# EAGLE design EnsembleOne (EAGLE 7.6.0)
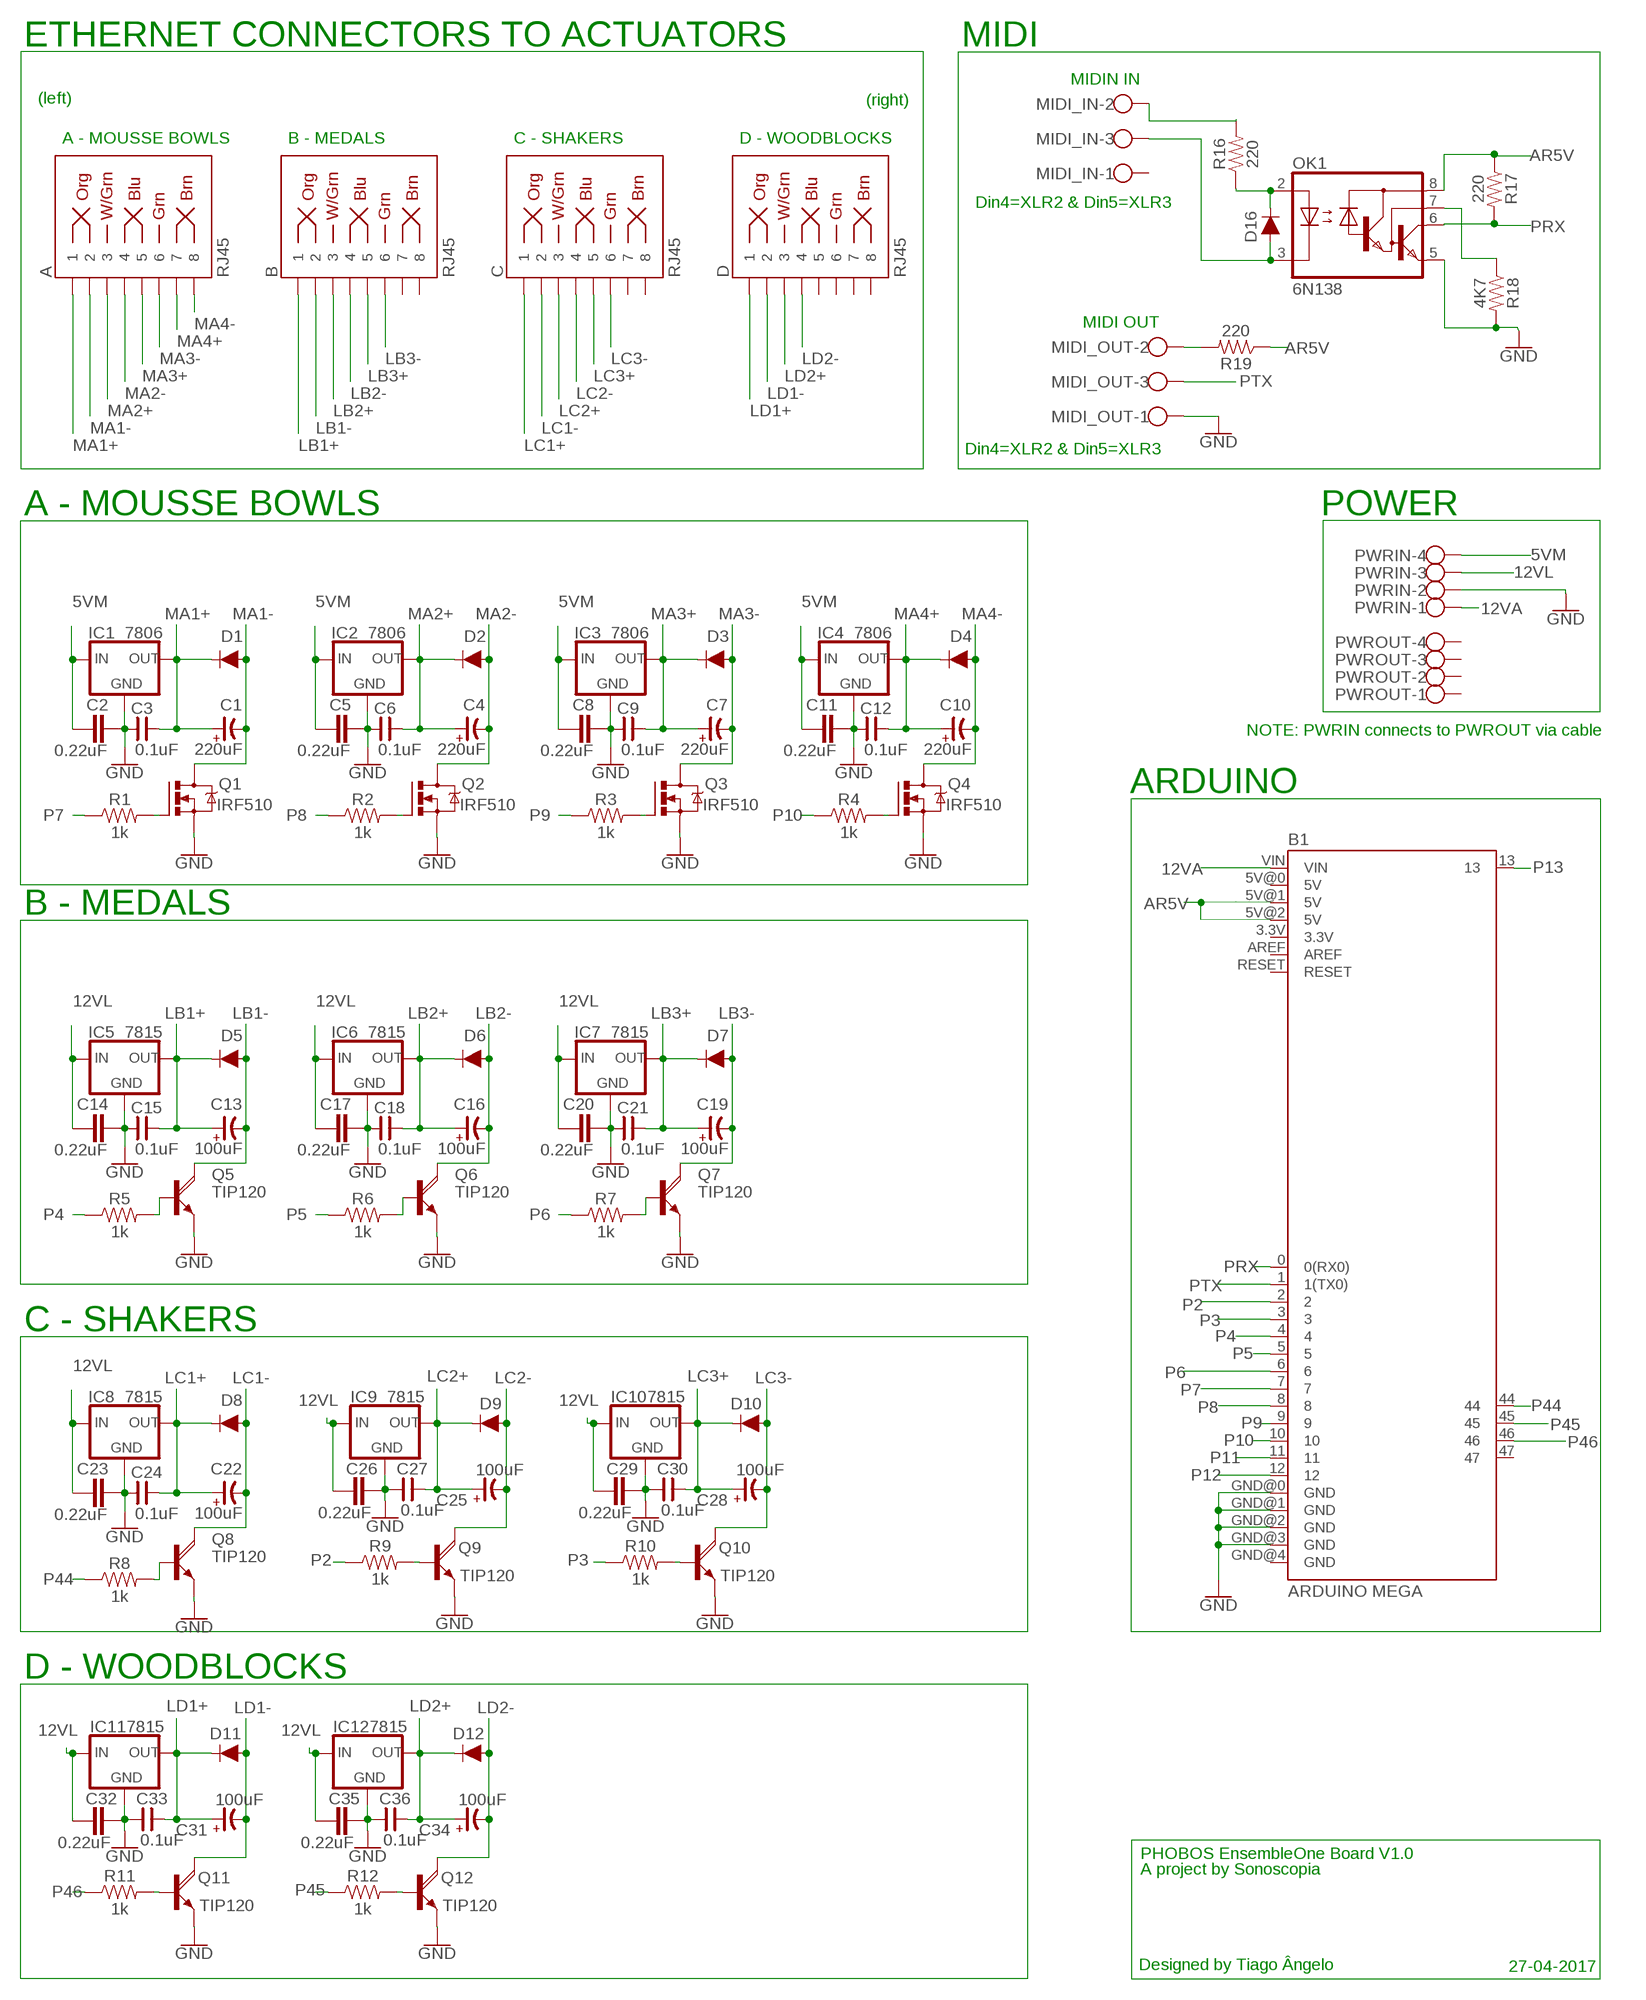
[diagram p0: schematic, sheet 1]

## Parts
A  RJ45  RJ45-8  [RJ45-8]
B  RJ45  RJ45-8  [RJ45-8]
B1  ARDUINO MEGA  ENSEMBLE_ONE_ARDUINO_MEGA_R3  [ENSEMBLE_ONE_ARDUINO_MEGA]
C  RJ45  RJ45-8  [RJ45-8]
C1  220uF  CP-E-035X080  [E-035X080]
C2  0.22uF  C5/3  [C5B3]
C3  0.1uF  CNP-C025-050X025  [C025-050X025]
C4  220uF  CP-E-035X080  [E-035X080]
C5  0.22uF  C5/3  [C5B3]
C6  0.1uF  CNP-C025-050X025  [C025-050X025]
C7  220uF  CP-E-035X080  [E-035X080]
C8  0.22uF  C5/3  [C5B3]
C9  0.1uF  CNP-C025-050X025  [C025-050X025]
C10  220uF  CP-E-035X080  [E-035X080]
C11  0.22uF  C5/3  [C5B3]
C12  0.1uF  CNP-C025-050X025  [C025-050X025]
C13  100uF  CAP-MASTER_CP-E-020X050  [CAP-MASTER_E-020X050]
C14  0.22uF  C5/3  [C5B3]
C15  0.1uF  CNP-C025-050X025  [C025-050X025]
C16  100uF  CAP-MASTER_CP-E-020X050  [CAP-MASTER_E-020X050]
C17  0.22uF  C5/3  [C5B3]
C18  0.1uF  CNP-C025-050X025  [C025-050X025]
C19  100uF  CAP-MASTER_CP-E-020X050  [CAP-MASTER_E-020X050]
C20  0.22uF  C5/3  [C5B3]
C21  0.1uF  CNP-C025-050X025  [C025-050X025]
C22  100uF  CAP-MASTER_CP-E-020X050  [CAP-MASTER_E-020X050]
C23  0.22uF  C5/3  [C5B3]
C24  0.1uF  CNP-C025-050X025  [C025-050X025]
C25  100uF  CP-E-020X050  [E-020X050]
C26  0.22uF  C5/3  [C5B3]
C27  0.1uF  CNP-C025-050X025  [C025-050X025]
C28  100uF  CP-E-020X050  [E-020X050]
C29  0.22uF  C5/3  [C5B3]
C30  0.1uF  CNP-C025-050X025  [C025-050X025]
C31  100uF  CP-E-020X050  [E-020X050]
C32  0.22uF  C5/3  [C5B3]
C33  0.1uF  CNP-C025-050X025  [C025-050X025]
C34  100uF  CP-E-020X050  [E-020X050]
C35  0.22uF  C5/3  [C5B3]
C36  0.1uF  CNP-C025-050X025  [C025-050X025]
D  RJ45  RJ45-8  [RJ45-8]
D1  1A/50V/1.1V  DIODE-KIT2  [DIODE-1N4001-KIT]
D2  1A/50V/1.1V  DIODE-KIT2  [DIODE-1N4001-KIT]
D3  1A/50V/1.1V  DIODE-KIT2  [DIODE-1N4001-KIT]
D4  1A/50V/1.1V  DIODE-KIT2  [DIODE-1N4001-KIT]
D5  1A/50V/1.1V  DIODE-KIT2  [DIODE-1N4001-KIT]
D6  1A/50V/1.1V  DIODE-KIT2  [DIODE-1N4001-KIT]
D7  1A/50V/1.1V  DIODE-KIT2  [DIODE-1N4001-KIT]
D8  1A/50V/1.1V  DIODE-KIT2  [DIODE-1N4001-KIT]
D9  1A/50V/1.1V  DIODE-KIT2  [DIODE-1N4001-KIT]
D10  1A/50V/1.1V  DIODE-KIT2  [DIODE-1N4001-KIT]
D11  1A/50V/1.1V  DIODE-KIT2  [DIODE-1N4001-KIT]
D12  1A/50V/1.1V  DIODE-KIT2  [DIODE-1N4001-KIT]
D16  200mA/100V/1V  DIODE-1N4148  [DIODE-1N4148]
IC1  7806  78XXS  [78XXS]
IC2  7806  78XXS  [78XXS]
IC3  7806  78XXS  [78XXS]
IC4  7806  78XXS  [78XXS]
IC5  7815  78XXS  [78XXS]
IC6  7815  78XXS  [78XXS]
IC7  7815  78XXS  [78XXS]
IC8  7815  78XXS  [78XXS]
IC9  7815  78XXS  [78XXS]
IC10  7815  78XXS  [78XXS]
IC11  7815  78XXS  [78XXS]
IC12  7815  78XXS  [78XXS]
MIDI_IN  W237-103  [W237-103]
MIDI_OUT  W237-103  [W237-103]
OK1  6N138  [DIL08]
PWRIN  W237-4  [W237-4]
PWROUT  W237-4  [W237-4]
Q1  IRF510  IRF520  [TO220BV]
Q2  IRF510  IRF520  [TO220BV]
Q3  IRF510  IRF520  [TO220BV]
Q4  IRF510  IRF520  [TO220BV]
Q5  TIP120  ROCKETFARM_TIP120V  [ROCKETFARM_TO220AV]
Q6  TIP120  ROCKETFARM_TIP120V  [ROCKETFARM_TO220AV]
Q7  TIP120  ROCKETFARM_TIP120V  [ROCKETFARM_TO220AV]
Q8  TIP120  ROCKETFARM_TIP120V  [ROCKETFARM_TO220AV]
Q9  TIP120  TIP120V  [TO220AV]
Q10  TIP120  TIP120V  [TO220AV]
Q11  TIP120  TIP120V  [TO220AV]
Q12  TIP120  TIP120V  [TO220AV]
R1  1k  1KOHM-VERT-1/4W-1%  [AXIAL-0.1]
R2  1k  1KOHM-VERT-1/4W-1%  [AXIAL-0.1]
R3  1k  1KOHM-VERT-1/4W-1%  [AXIAL-0.1]
R4  1k  1KOHM-VERT-1/4W-1%  [AXIAL-0.1]
R5  1k  1KOHM-VERT-1/4W-1%  [AXIAL-0.1]
R6  1k  1KOHM-VERT-1/4W-1%  [AXIAL-0.1]
R7  1k  1KOHM-VERT-1/4W-1%  [AXIAL-0.1]
R8  1k  1KOHM-VERT-1/4W-1%  [AXIAL-0.1]
R9  1k  1KOHM-VERT-1/4W-1%  [AXIAL-0.1]
R10  1k  1KOHM-VERT-1/4W-1%  [AXIAL-0.1]
R11  1k  1KOHM-VERT-1/4W-1%  [AXIAL-0.1]
R12  1k  1KOHM-VERT-1/4W-1%  [AXIAL-0.1]
R16  220  1KOHM-HORIZ-1/4W-5%  [AXIAL-0.3]
R17  220  1KOHM-HORIZ-1/4W-5%  [AXIAL-0.3]
R18  4K7  1KOHM-HORIZ-1/4W-5%  [AXIAL-0.3]
R19  220  1KOHM-HORIZ-1/4W-5%  [AXIAL-0.3]

## Nets
5VM [5VM]: C2.1 C5.1 C8.1 C11.1 IC1.IN IC2.IN IC3.IN IC4.IN PWRIN.4
12VA [12VA]: B1.VIN PWRIN.1
12VL [12VL]: C14.1 C17.1 C20.1 C23.1 C26.1 C29.1 C32.1 C35.1 IC5.IN IC6.IN IC7.IN IC8.IN IC9.IN IC10.IN IC11.IN IC12.IN PWRIN.3
AR5V: B1.5V@1(5V) B1.5V@2(5V) OK1.8(VCC) R17.P$1 R19.P$1
GND [GND]: B1.GND@0(GND) B1.GND@1(GND) B1.GND@2(GND) B1.GND@3(GND) C2.2 C3.1 C5.2 C6.1 C8.2 C9.1 C11.2 C12.1 C14.2 C15.1 C17.2 C18.1 C20.2 C21.1 C23.2 C24.1 C26.2 C27.1 C29.2 C30.1 C32.2 C33.1 C35.2 C36.1 IC1.GND IC2.GND IC3.GND IC4.GND IC5.GND IC6.GND IC7.GND IC8.GND IC9.GND IC10.GND IC11.GND IC12.GND MIDI_OUT.1 OK1.5(GND) PWRIN.2 Q1.S Q2.S Q3.S Q4.S Q5.E Q6.E Q7.E Q8.E Q9.E Q10.E Q11.E Q12.E R18.P$2
LB1+: B.1 C13.+ C15.2 D5.C IC5.OUT
LB1-: B.2 C13.- D5.A Q5.C
LB2+: B.3 C16.+ C18.2 D6.C IC6.OUT
LB2-: B.4 C16.- D6.A Q6.C
LB3+: B.5 C19.+ C21.2 D7.C IC7.OUT
LB3-: B.6 C19.- D7.A Q7.C
LC1+: C22.+ C24.2 C.1 D8.C IC8.OUT
LC1-: C22.- C.2 D8.A Q8.C
LC2+: C25.+ C27.2 C.3 D9.C IC9.OUT
LC2-: C25.- C.4 D9.A Q9.C
LC3+: C28.+ C30.2 C.5 D10.C IC10.OUT
LC3-: C28.- C.6 D10.A Q10.C
LD1+: C31.+ C33.2 D11.C D.1 IC11.OUT
LD1-: C31.- D11.A D.2 Q11.C
LD2+: C34.+ C36.2 D12.C D.3 IC12.OUT
LD2-: C34.- D12.A D.4 Q12.C
MA1+: A.1 C1.+ C3.2 D1.C IC1.OUT
MA1-: A.2 C1.- D1.A Q1.D
MA2+: A.3 C4.+ C6.2 D2.C IC2.OUT
MA2-: A.4 C4.- D2.A Q2.D
MA3+: A.5 C7.+ C9.2 D3.C IC3.OUT
MA3-: A.6 C7.- D3.A Q3.D
MA4+: A.7 C10.+ C12.2 D4.C IC4.OUT
MA4-: A.8 C10.- D4.A Q4.D
N$1: Q1.G R1.P$2
N$2: MIDI_OUT.2 R19.P$2
N$3: Q2.G R2.P$2
N$4: Q10.B R10.P$2
N$5: Q11.B R11.P$2
N$9: Q9.B R9.P$2
N$14: Q3.G R3.P$2
N$15: Q4.G R4.P$2
N$16: Q5.B R5.P$2
N$18: Q6.B R6.P$2
N$19: Q7.B R7.P$2
N$20: Q8.B R8.P$2
N$21: Q12.B R12.P$2
N$25: D16.A MIDI_IN.3 OK1.3(C)
N$26: D16.C OK1.2(A) R16.P$1
N$27: MIDI_IN.2 R16.P$2
N$29: OK1.7(VB) R18.P$1
P2: B1.2 R9.P$1
P3: B1.3 R10.P$1
P4: B1.4 R5.P$1
P5: B1.5 R6.P$1
P6: B1.6 R7.P$1
P7: B1.7 R1.P$1
P8: B1.8 R2.P$1
P9: B1.9 R3.P$1
P10: B1.10 R4.P$1
P11: B1.11
P12: B1.12
P13: B1.13
P44: B1.44 R8.P$1
P45: B1.45 R12.P$1
P46: B1.46 R11.P$1
PRX: B1.0(0(RX0)) OK1.6(VO) R17.P$2
PTX: B1.1(1(TX0)) MIDI_OUT.3
Unconnected: B1.3.3V B1.5V@0(5V) B1.47 B1.AREF B1.GND@4(GND) B1.RESET B.7 B.8 C.7 C.8 D.5 D.6 D.7 D.8 MIDI_IN.1 PWROUT.1 PWROUT.2 PWROUT.3 PWROUT.4

## Notes on the sheet
- ETHERNET CONNECTORS TO ACTUATORS | MIDI
- MIDIN IN
- (left) | (right)
- A - MOUSSE BOWLS | B - MEDALS | C - SHAKERS | D - WOODBLOCKS
- Din4=XLR2 & Din5=XLR3
- MIDI OUT
- Din4=XLR2 & Din5=XLR3
- A - MOUSSE BOWLS | POWER
- NOTE: PWRIN connects to PWROUT via cable
- ARDUINO
- B - MEDALS
- C - SHAKERS
- D - WOODBLOCKS
- PHOBOS EnsembleOne Board V1.0
- A project by Sonoscopia
- Designed by Tiago Ângelo | 27-04-2017

## Library data of the parts
A B C D = SparkFun-Connectors:RJ45-8: RJ45 Jack - 8 pin Simple RJ45, 8-pin connection. Commonly used for Cat5, Cat5e, and Cat6 Ethernet cables. Here is the connector we sell at SparkFun: RJ45 8-Pin Connector <https://www.sparkfun.com/products/643> (PRT-00643) Datasheet <https://cdn.sparkfun.com/datasheets/Prototyping/04908.pdf> It is used on this SparkFun product: SparkFun RJ45 Breakout <https://www.sparkfun.com/products/716> (BOB-00716) Note, you may also be interested in the "MAGJACK" version of this. It is basically a RJ45 connector, but also has some status LEDs built into the connector housing. You can check that out in this library at the device named "MAGJACK.dev" and see these products online: RJ45 Ethernet MagJack-Compatible <https://www.sparkfun.com/products/8534> (PRT-08534) SparkFun RJ45 MagJack Breakout <https://www.sparkfun.com/products/13021> (BOB-13021); PROD_ID: CONN-08506; SF_ID: PRT-00643
B1 = PHOBOS-lbr:ENSEMBLE_ONE_ARDUINO_MEGA_R3: Arduino Mega R3 ATmega2560 R3 compatible footprint. SparkFun Products: Arduino Mega 2560 R3 <https://www.sparkfun.com/products/11061>
C1 C4 C7 C10 C25 C28 C31 C34 = cap-master:CP-: POLARIZED CAP
C2 C5 C8 C11 C14 C17 C20 C23 C26 C29 C32 C35 = capacitor-wima:C: CAPACITOR naming: grid - package width
C3 C6 C9 C12 C15 C18 C21 C24 C27 C30 C33 C36 = cap-master:CNP-: NON-POLARIZED CAP
C13 C16 C19 C22 = PHOBOS-lbr:CAP-MASTER_CP-: POLARIZED CAP
D1-D12 = SparkFun-DiscreteSemi:DIODE: Diode These are standard reverse protection diodes and small signal diodes. SparkFun Products: SparkFun SparkPunk Sound Kit <https://www.sparkfun.com/products/11177> SparkFun ESP8266 Thing <https://www.sparkfun.com/products/13231>; PROD_ID: DIO-09176
D16 = SparkFun-DiscreteSemi:DIODE: Diode These are standard reverse protection diodes and small signal diodes. SparkFun Products: SparkFun SparkPunk Sound Kit <https://www.sparkfun.com/products/11177> SparkFun ESP8266 Thing <https://www.sparkfun.com/products/13231>; PROD_ID: DIO-08378
IC1-IC12 = v-reg:78XXS: VOLTAGE REGULATOR
MIDI_IN MIDI_OUT = con-wago-500:W237-103: WAGO SCREW CLAMP; MPN: 237-103; OC_FARNELL: unknown; OC_NEWARK: 18M7116
OK1 = optocoupler:6N138: MOTOROLA OPTO COUPLER; MF: VISHAY/TELEFUNKEN; MPN: 6N138; OC_FARNELL: 9860150; OC_NEWARK: 35K5294
PWRIN PWROUT = con-wago-500:W237-4: WAGO SCREW CLAMP; OC_FARNELL: unknown; OC_NEWARK: unknown
Q1-Q4 = transistor-power:IRF520: HEXFET Power MOSFET
Q5-Q8 = PHOBOS-lbr:ROCKETFARM_TIP120: NPN DARLINGTON TRANSISTOR
Q9-Q12 = rocketfarm:TIP120: NPN DARLINGTON TRANSISTOR
R1-R12 = SparkFun-Resistors:1KOHM: 1kΩ resistor A resistor is a passive two-terminal electrical component that implements electrical resistance as a circuit element. Resistors act to reduce current flow, and, at the same time, act to lower voltage levels within circuits. - Wikipedia; PROD_ID: RES-12182
R16-R19 = SparkFun-Resistors:1KOHM: 1kΩ resistor A resistor is a passive two-terminal electrical component that implements electrical resistance as a circuit element. Resistors act to reduce current flow, and, at the same time, act to lower voltage levels within circuits. - Wikipedia; PROD_ID: RES-08380; VALUE: 1k

## Net classes
0 default: width 0.508 mm, drill 0.508 mm, clearance 0.406 mm
1 GND: width 1.016 mm, drill 0.508 mm, clearance 0.508 mm
2 5VM: width 1.016 mm, drill 0.508 mm, clearance 0.508 mm
3 12VL: width 0.61 mm, drill 0.508 mm, clearance 0.508 mm
4 12VA: width 0.508 mm, drill 0.508 mm, clearance 0.508 mm

## Board
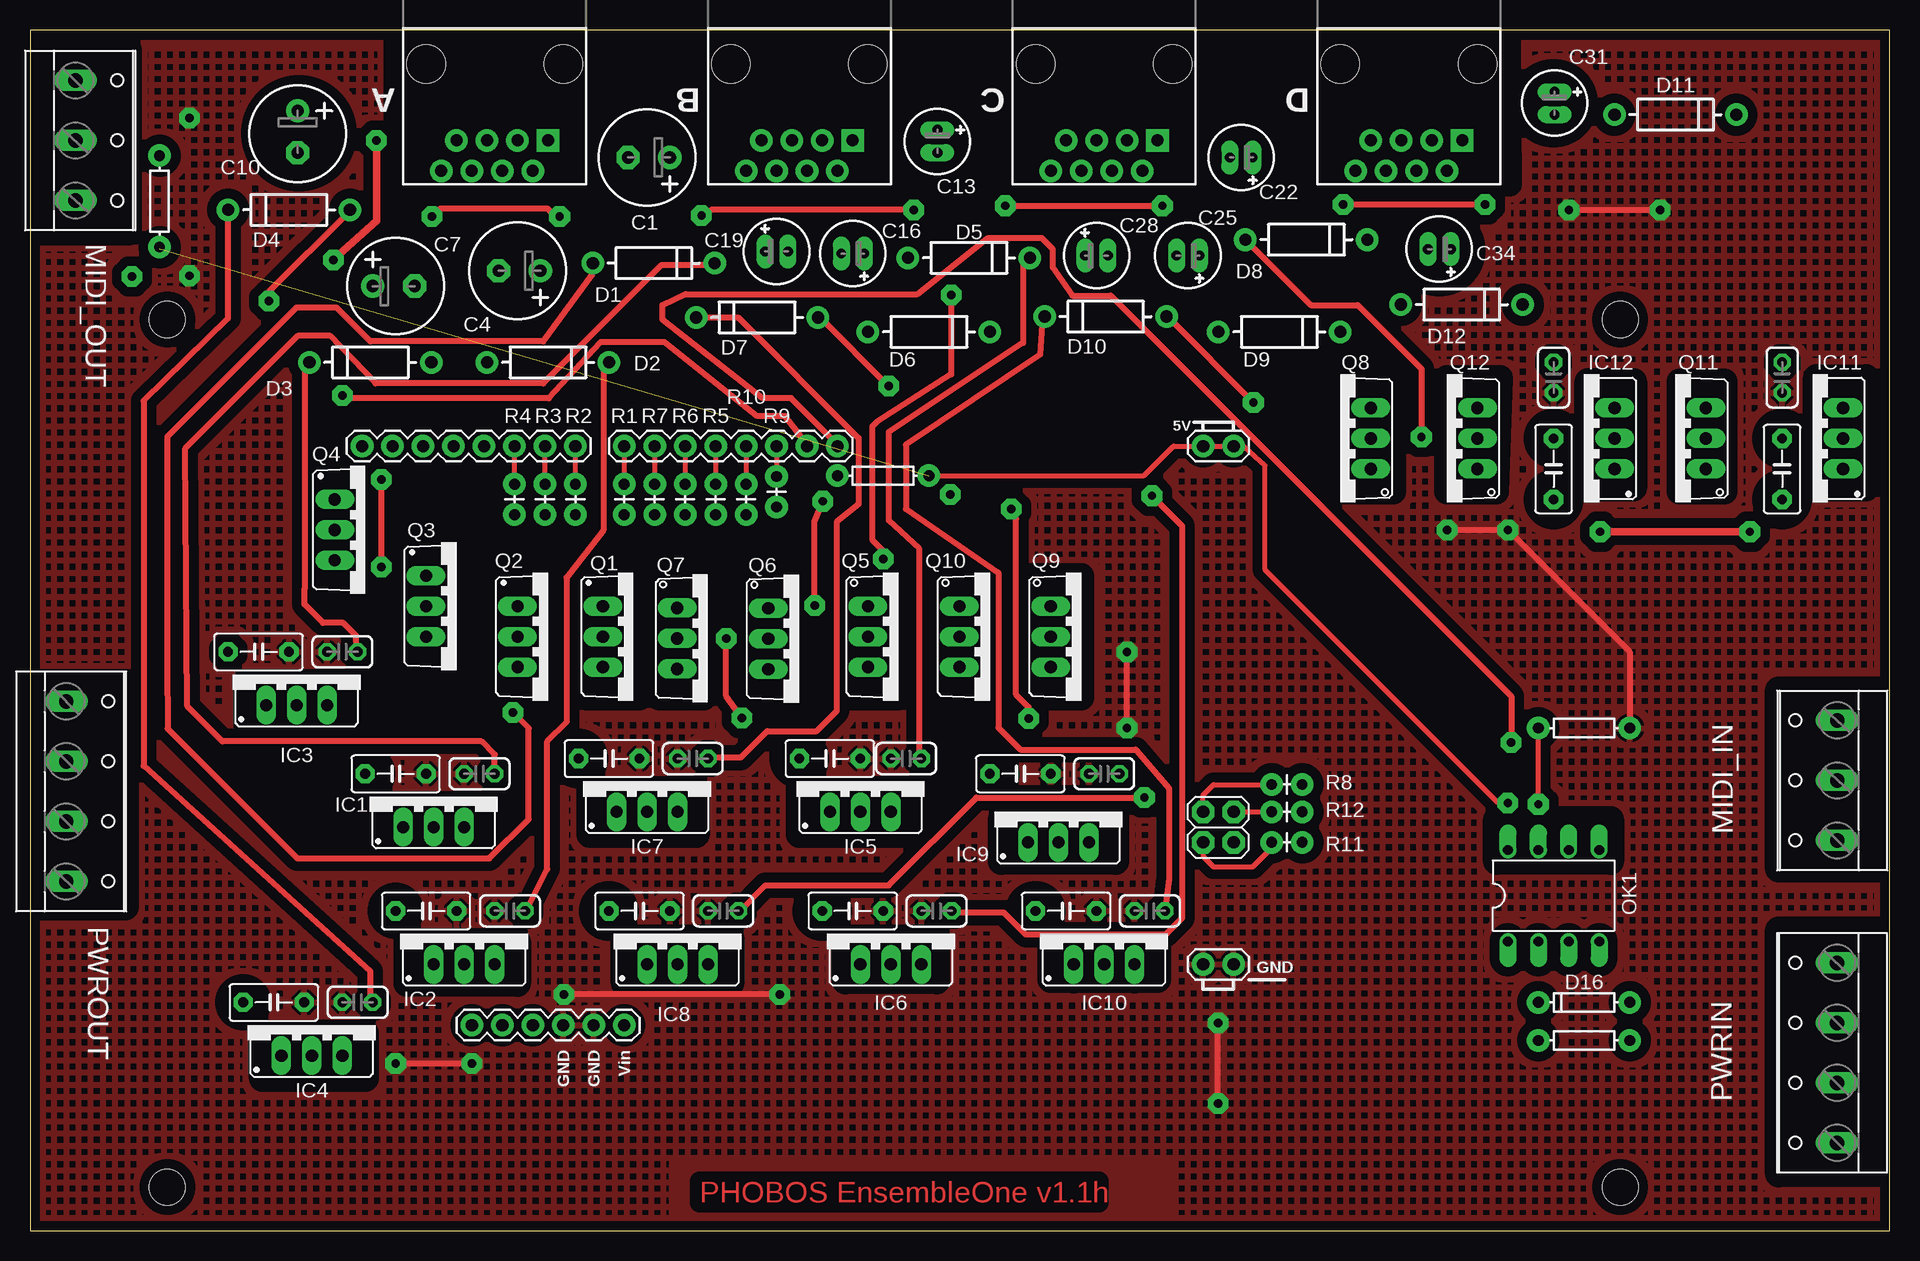
[diagram p1: board, top side]
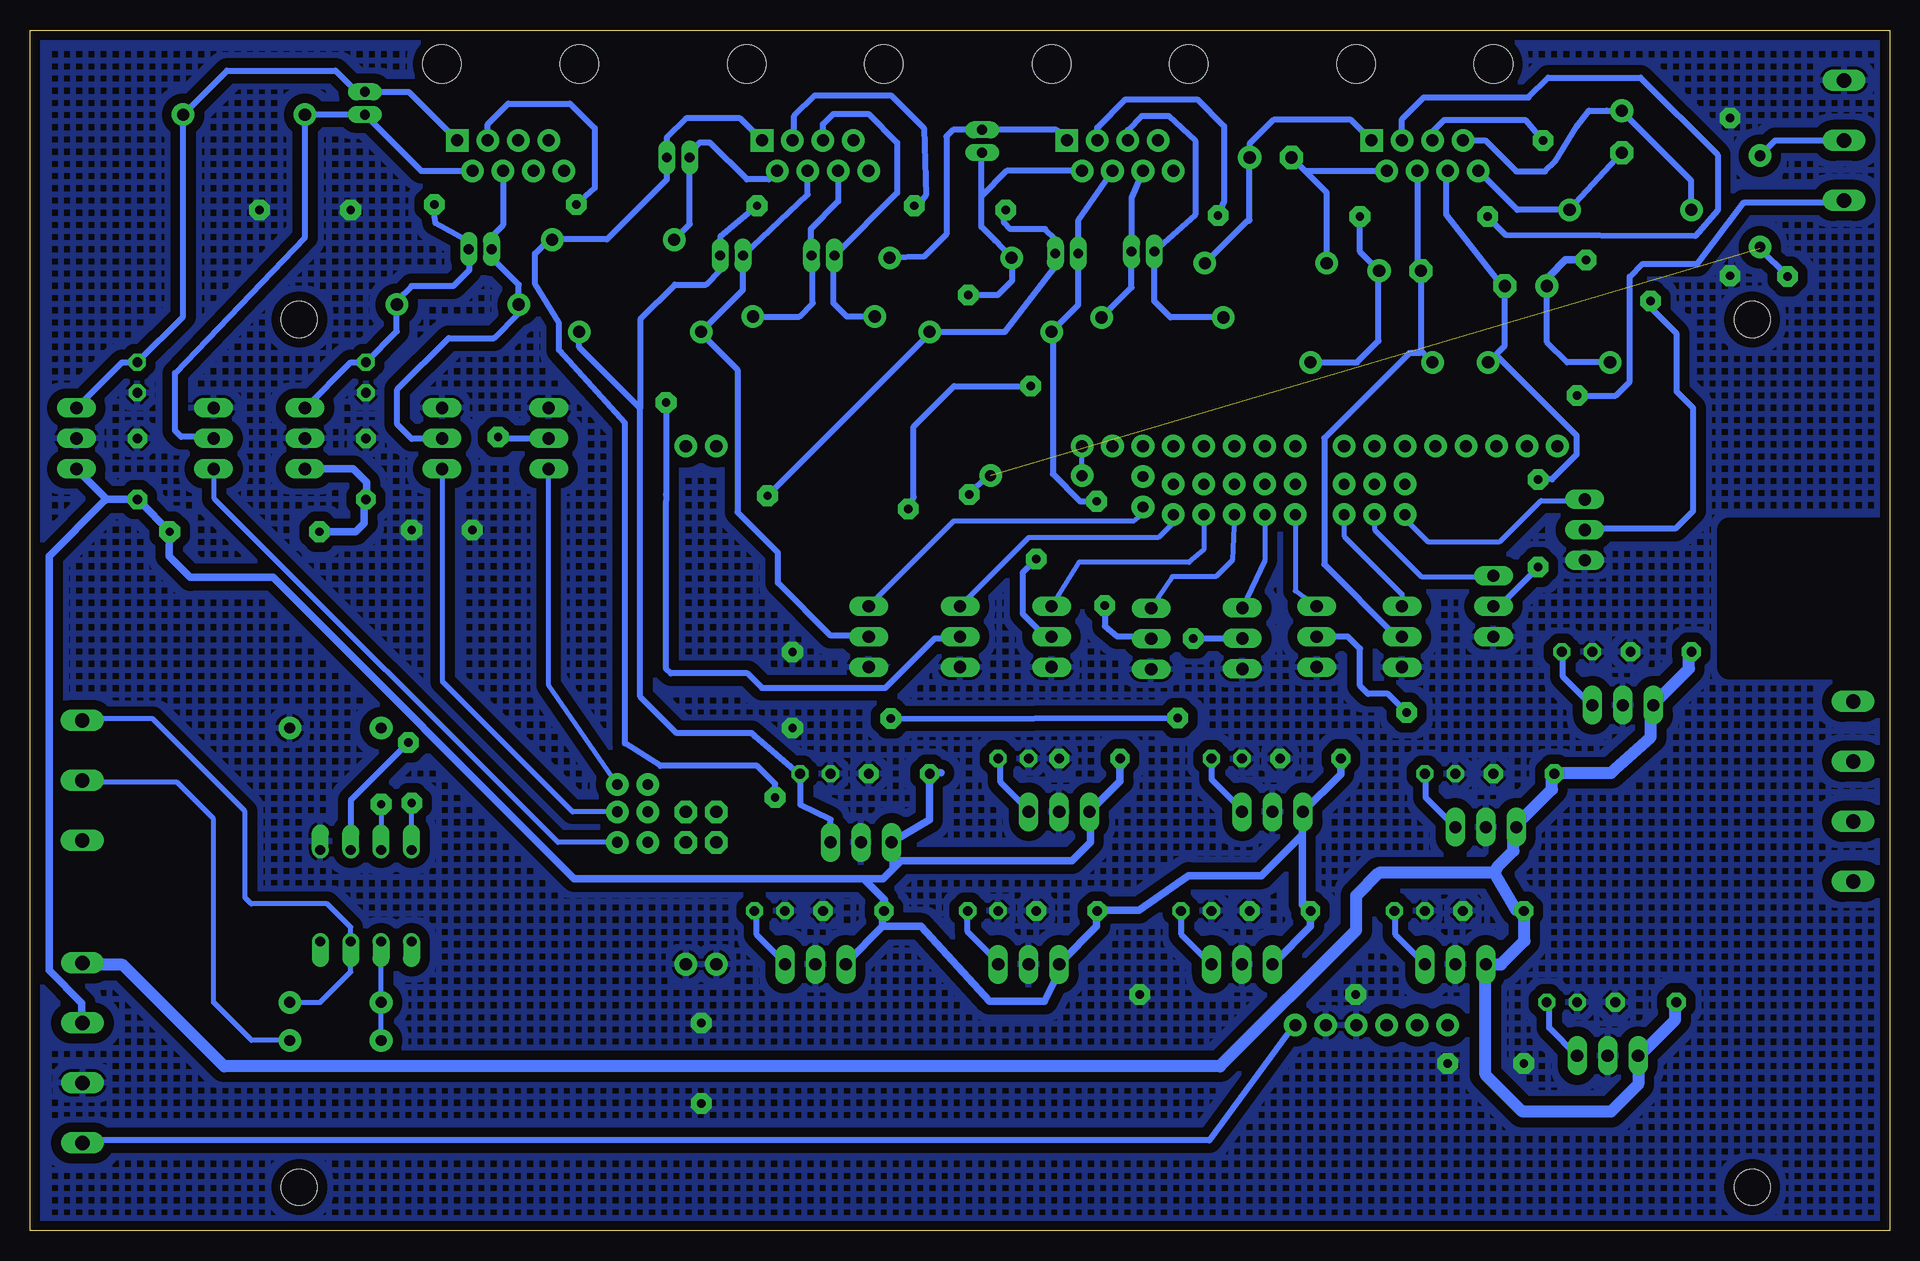
[diagram p2: board, bottom side, seen from below]

Size 155 x 100.08 mm. Coordinates in mm from the lower left corner, seen from the top.
Outline: 0,0 155,0 155,100.08 0,100.08 0,0
Copper layers (1*16): Top 0.035mm / dielectric 1.5mm / Bottom 0.035mm
Design rules "Dek": minimum track width 12mil, minimum drill 36mil, track to track 12mil, track to pad 12mil, pad to pad 12mil, via to via 12mil, smd to smd 0mil, copper to edge 10mil, drill to drill 12mil, minimum pad ring 12mil, minimum via ring 20mil, stop-mask expansion 4mil, vias tented up to drill 25mil, thermal gap 10mil
Holes 3 mm at 132.55,75.95 132.55,3.65 11.45,3.65 11.45,75.95
Holes 1.5 mm at -15.24,52.07 193.04,6.35 193.04,93.98
tRestrict: area 30.5,86.4 to 47,108; area 55.9,86.4 to 72.4,108; area 81.3,87.2 to 97.8,108; area 106.7,87.2 to 123.4,108; area 18.7,87.8 to 26.1,95.2; area 26.9,75.1 to 34.1,82.2; area 36.8,76.1 to 44.5,83.7; area 47.8,85.9 to 55.1,93.2; area 59.5,78.9 to 65,84.4; area 66,79 to 71.1,84.1; area 73,88.2 to 78.1,93.4; area 86.3,78.6 to 91.6,83.9; 46 more areas
bRestrict: area -2.5,47 to 13.3,58.4
vRestrict: area 71.1,64.1 to 91.4,66.7; area 96.5,36.2 to 101.6,64.1; area 96.5,23.5 to 101.6,31.1; area 53.3,15.9 to 73.7,18.4; area 76.2,15.9 to 96.5,18.4; area -2.5,47 to 13.3,58.4; area 122.2,25.1 to 132.1,30.8; area 10.2,84.5 to 11.4,89.5; area 18.5,83.9 to 24.7,86.3; area 25.2,71.2 to 31.5,73.6; area 40.1,71.2 to 46.3,73.6; area 57.6,74.8 to 63.6,77.4; 8 more areas

### Footprints (pad centres in the part's own frame; a part is rotated, then mirrored left to right if it is on the bottom)
RJ45-8 = drill 1 pad 1.88 square: 1 -4.445,6.35 | drill 1 pad 1.88: 2 -3.175,8.89; 3 -1.905,6.35; 4 -0.635,8.89; 5 0.635,6.35; 6 1.905,8.89; 7 3.175,6.35; 8 4.445,8.89 | hole 3.2: -5.715,0; 5.715,0
ENSEMBLE_ONE_ARDUINO_MEGA = drill 1.016 pad 1.88: 0 13.97,24.13; 1 11.43,24.13; 2 8.89,24.13; 3 6.35,24.13; 3.3V -13.97,-24.13; 4 3.81,24.13; 5 1.27,24.13; 5V@0 -11.43,-24.13; 5V@1 44.45,24.13; 5V@2 46.99,24.13; 6 -1.27,24.13; 7 -3.81,24.13; 8 -7.874,24.13; 9 -10.414,24.13; 10 -12.954,24.13; 11 -15.494,24.13; 12 -18.034,24.13; 13 -20.574,24.13; AREF -25.654,24.13; GND@0 -8.89,-24.13; GND@1 -6.35,-24.13; GND@2 44.45,-19.05; GND@3 46.99,-19.05; GND@4 -23.114,24.13; RESET -16.51,-24.13; VIN -3.81,-24.13 | drill 1.016 pad 1.88 octagon: 44 44.45,-6.35; 45 46.99,-6.35; 46 44.45,-8.89; 47 46.99,-8.89
E-035X080 = drill 1.016 pad 1.93: + -1.905,0 | drill 1.016 pad 1.93 octagon: - 1.587,0
C5B3 = drill 0.813 pad 1.6 octagon: 1 -2.54,0; 2 2.54,0
C025-050X025 = drill 0.813 pad 1.422 octagon: 1 -1.27,0; 2 1.27,0
CAP-MASTER_E-020X050 = drill 0.813 long: + -0.953,0; - 0.953,0
E-020X050 = drill 0.813 long: + -0.953,0; - 0.953,0
DIODE-1N4001-KIT = drill 1.016 pad 1.88: A -5.08,0; C 5.08,0
DIODE-1N4148 = drill 0.9 pad 1.88: A -3.81,0; C 3.81,0
78XXS = drill 1.016 long: GND 0,-2.54; IN -2.54,-2.54; OUT 2.54,-2.54
W237-103 = drill 1.194 long: 1 -5,-1.29; 2 0,-1.29; 3 5,-1.29
DIL08 = drill 0.813 offset: 1 -3.81,-3.81; 2 -1.27,-3.81; 3 1.27,-3.81; 4 3.81,-3.81; 5 3.81,3.81; 6 1.27,3.81; 7 -1.27,3.81; 8 -3.81,3.81
W237-4 = drill 1.194 long: 1 -7.5,-1.27; 2 -2.5,-1.27; 3 2.5,-1.27; 4 7.5,-1.27
TO220BV = drill 1.016 long: D 0,-2.54; G -2.54,-2.54; S 2.54,-2.54
ROCKETFARM_TO220AV = drill 1.016 long: B -2.54,-2.54; C 0,-2.54; E 2.54,-2.54
TO220AV = drill 1.016 long: B -2.54,-2.54; C 0,-2.54; E 2.54,-2.54
AXIAL-0.1 = drill 0.9 pad 1.88: P$1 -1.27,0; P$2 1.27,0
AXIAL-0.3 = drill 0.9 pad 1.88: P$1 -3.81,0; P$2 3.81,0

### Placement (x,y rotation side)
A  38.73,97.23 180 top
B  64.13,97.23 180 top
B1  53.34,41.27 0 top
C  89.53,97.23 180 top
C1  51.43,89.46 180 top
C2  30.48,38.1 0 top
C3  37.46,38.1 0 top
C4  40.64,80.01 180 top
C5  33.02,26.67 0 top
C6  40.01,26.67 0 top
C7  30.48,78.74 0 top
C8  19.05,48.26 0 top
C9  26.03,48.26 0 top
C10  22.3,91.44 270 top
C11  20.32,19.05 0 top
C12  27.3,19.05 0 top
C13  75.64,90.81 270 top
C14  66.68,39.37 0 top
C15  73.03,39.37 0 top
C16  68.58,81.45 180 top
C17  68.58,26.67 0 top
C18  75.56,26.67 0 top
C19  62.23,81.62 0 top
C20  48.26,39.37 0 top
C21  55.24,39.37 0 top
C22  100.97,89.46 180 top
C23  50.8,26.67 0 top
C24  57.79,26.67 0 top
C25  96.52,81.28 180 top
C26  82.55,38.1 0 top
C27  89.53,38.1 0 top
C28  88.9,81.28 0 top
C29  86.36,26.67 0 top
C30  93.34,26.67 0 top
C31  127.08,93.98 270 top
C32  146.05,63.5 90 top
C33  146.05,71.12 90 top
C34  117.47,81.81 180 top
C35  127,63.5 90 top
C36  127,71.12 90 top
D  114.94,97.23 180 top
D1  51.99,80.64 0 top
D2  43.18,72.39 0 top
D3  28.37,72.38 180 top
D4  21.59,85.09 180 top
D5  78.26,81.1 0 top
D6  74.93,74.93 0 top
D7  60.6,76.12 180 top
D8  106.39,82.6 0 top
D9  104.14,74.93 0 top
D10  89.66,76.2 180 top
D11  137.16,93.03 0 top
D12  119.34,77.2 0 top
D16  129.54,19.05 180 top
IC1  33.66,36.2 0 top
IC2  36.2,24.77 0 top
IC3  22.23,46.35 0 top
IC4  23.49,17.14 0 top
IC5  69.22,37.47 0 top
IC6  71.75,24.77 0 top
IC7  51.43,37.47 0 top
IC8  53.98,24.77 0 top
IC9  85.72,34.92 0 top
IC10  89.53,24.77 0 top
IC11  148.59,66.04 90 top
IC12  129.54,66.04 90 top
MIDI_IN  149.35,37.54 90 top
MIDI_OUT  5.08,90.88 270 top
OK1  127,27.94 0 top
PWRIN  149.35,14.84 90 top
PWROUT  4.3,36.63 270 top
Q1  50.29,49.53 270 top
Q2  43.18,49.53 270 top
Q3  35.56,52.07 270 top
Q4  27.94,58.42 270 top
Q5  72.39,49.53 270 top
Q6  64.08,49.36 270 top
Q7  56.49,49.38 270 top
Q8  109.22,66.04 90 top
Q9  87.63,49.53 270 top
Q10  80.01,49.53 270 top
Q11  137.16,66.04 90 top
Q12  118.11,66.04 90 top
R1  49.53,60.96 270 top
R2  45.47,60.96 270 top
R3  42.93,60.96 270 top
R4  40.39,60.96 270 top
R5  57.15,60.96 270 top
R6  54.61,60.96 270 top
R7  52.07,60.96 270 top
R8  104.78,37.21 0 top
R9  62.23,61.59 270 top
R10  59.69,60.96 270 top
R11  104.78,32.38 0 top
R12  104.78,34.92 0 top
R16  129.54,15.88 0 top
R17  71.12,62.94 180 top
R18  129.54,41.91 0 top
R19  10.79,85.8 90 top

### Tracks (layer width: path | path; a pad name or v marks a point on that pad's centre or on a via)
5VM
  Bottom 1.016: C11.1 17.86,18.97 17.86,17.6 20.83,14.63 IC4.IN 20.95,12.22 23.23,9.94 30.6,9.94 33.69,13.03 33.69,22.19 IC2.IN 32.38,22.23 30.43,24.17 30.43,26.62 C5.1 31.12,26.75 32.94,29.84 | C8.1 16.71,48.23 16.71,46.86 19.69,43.89 IC3.IN 19.91,43.43 19.91,41.15 23.23,38.18 27.46,38.18 C2.1 28.14,37.95 28.14,36.8 31.12,33.83 IC1.IN 31.34,33.38 31.34,31.67 32.71,30.3 32.94,29.84 | 32.94,29.84 42.55,29.84 44.45,27.94 44.45,25.07 55.8,13.72 138.81,13.72 147.27,22.17 150.44,22.17 PWRIN.4
12VA
  Bottom 0.508: PWRIN.1 150.44,7.54 56.69,7.54 49.63,17.14 B1.VIN
12VL  (via drill 0.7)
  Top 0.61: v143.36,58.27 v130.86,58.27
  Bottom 0.61: IC11.IN 148.59,60.96 | 148.59,60.96 C32.1 145.87,60.81 v143.36,58.27 143.42,58.21 143.42,56.24 141.64,54.46 134.72,54.46 109.63,29.36 85.51,29.36 | PWRIN.3 150.67,17.37 150.67,18.97 153.42,21.72 153.42,56.24 148.84,60.81 148.59,60.96 | 64.49,39.22 C14.1 64.13,37.47 IC5.IN 66.6,34.85 66.6,32.4 68.15,30.86 82.38,30.86 83.06,30.18 | 83.92,25.38 83.92,26.52 C29.1 83.75,26.74 83.75,27.6 85.51,29.36 | 83.92,25.38 86.89,22.4 IC10.IN | C20.1 45.74,39.22 45.74,38.08 IC7.IN 48.95,34.65 48.95,33.02 | IC8.IN 51.23,22.4 48.26,25.38 C23.1 48.49,26.75 48.95,27.2 48.95,33.02 | 83.92,25.38 80.72,25.38 75.01,19.14 70.43,19.14 69.29,21.49 69.29,21.95 IC6.IN 69.06,22.4 66.09,25.38 66.09,26.52 C17.1 65.86,26.75 62.56,26.75 58.42,29.62 52.35,29.62 48.95,33.02 | v130.86,58.27 127.84,58.27 127.13,58.98 127.13,60.83 C35.1 126.96,61 126.96,62.41 128.05,63.5 IC12.IN | 79.06,38.18 79.81,38.18 C26.1 80.03,37.95 80.03,34.27 IC9.IN 83.06,32.26 83.06,30.18 | 85.51,29.36 83.88,29.36 83.06,30.18
AR5V  (via drill 0.7)  (1 unrouted)
  Top 0.406: R17.P$1 92.85,62.94 95.32,65.41 B1.5V@1 B1.5V@2 101.16,65.41 101.24,65.32 102.95,63.78 102.95,55.11 122.4,35.66 v123.18,35.66
  Bottom 0.406: OK1.8 v123.18,35.66
  Bottom 0.508: v8.48,79.55 10.79,81.86 R19.P$1 | v76.72,61.38 75.16,62.94 R17.P$1
GND  (via drill 0.7)
  Top 0.508: v118.11,58.42 v123.19,58.42 133.35,48.26 R18.P$2 | v128.27,85.09 v135.89,85.09 | v99.03,10.63 v99.03,17.32 | v30.48,13.97 v36.83,13.97 | v62.49,19.72 v44.49,19.72 | v91.44,41.91 v91.44,48.26
  other vias: 13.28,79.6 13.28,92.75
  pour Bottom (isolate 0.813, rank 2, hatched): -5.08,104.14 160.02,104.14 160.02,0 -5.08,0
  pour Top (isolate 0.813, hatched): -3.81,102.87 158.75,102.87 158.75,-2.54 -3.81,-2.54
LB1+
  Top 0.508: C15.2 74.09,39.45 74.09,56.9 71.58,59.21 71.58,66.58 82.78,74.01 82.78,80.47 83.24,80.92 D5.C
  Bottom 0.508: D5.C 80.49,81.2 78.61,83.08 78.61,91.21 78.06,91.76 C13.+ 69.46,91.76 B.1 | C15.2 74.09,39.22 74.09,37.39 71.81,35.1 IC5.OUT
LB1-  (via drill 0.7)
  Top 0.508: v76.78,78.01 76.78,71.38 70.61,67.44 70.21,67.04 70.21,57.61 71.12,56.69 v71.12,56.01
  Bottom 0.508: D5.A 74.57,82.55 75.69,83.67 75.69,86.24 | 75.69,86.24 75.69,89.8 C13.- | B.2 73.59,88.34 75.69,86.24 | v71.12,56.01 72.26,54.86 72.26,51.44 70.43,49.61 69.98,49.61 Q5.C | 73.41,80.92 D5.A | v76.78,78.01 74.32,78.01 73.12,79.21 73.12,81.03 D5.A
LB2+  (via drill 0.7)
  Top 0.508: v55.98,84.63 56.78,85.09 v73.66,85.09 | v93.52,61.27 96.04,58.75 96.04,26.06 94.67,24.69 83.01,24.69 81.18,26.52 76.84,26.52 C18.2
  Bottom 0.508: B.3 66.04,91.95 63.69,94.3 57.69,94.3 55.46,92.07 55.46,85.83 v55.98,84.63 | v73.66,85.09 73.81,84.94 73.81,84.01 73.29,83.5 70.38,83.5 69.53,82.65 C16.+ 69.53,80.4 73.73,74.93 D6.C 80.03,74.75 v93.52,61.27 | C18.2 76.84,24.92 74.32,22.4 IC6.OUT
LB2-  (via drill 0.7)
  Top 0.508: v65.41,52.12 65.38,59.1 v66.09,60.81
  Bottom 0.508: B.4 67.63,84.21 C16.- 67.63,77.15 D6.A 69.75,74.75 69.75,63.09 67.46,60.81 v66.09,60.81 | 62.36,49.66 Q6.C 62.25,49.55 64.38,49.55 65.41,50.41 v65.41,52.12
LB3+
  Top 0.508: D7.C 59,76.12 69.06,66.06 69.06,60.58 67.23,59.09 67.23,43.32 65.58,41.66 61.45,41.66 59.23,39.45 56.72,39.45 C21.2
  Bottom 0.508: B.5 63.5,91.75 62.32,92.93 60.09,92.93 57.86,90.87 57.86,84.7 C19.+ 61.29,81.27 61.29,77.5 59.92,76.12 D7.C | C21.2 56.49,39.22 56.49,37.62 53.98,35.1 IC7.OUT
LB3-  (via drill 0.7)
  Top 0.508: v83.24,42.69 83.24,43.66 82.21,44.69 82.21,59.32 81.81,59.72 v81.81,60.18 | v71.58,70.41 65.86,76.12 D7.A | v59.32,42.76 58.03,44.56 v58.03,49.38
  Bottom 0.508: B.6 63.18,86.12 C19.- 63.18,78.63 D7.A | v83.24,42.69 v59.32,42.76 | v81.81,60.18 81.35,61.15 81.35,67.04 77.98,70.41 v71.58,70.41 | v58.03,49.38 Q7.C
LC1+  (via drill 0.7)
  Top 0.508: v92.89,36.12 78.89,36.12 71.58,28.8 61.29,28.8 59.23,26.75 C24.2
  Bottom 0.508: C.1 95.81,92.71 100.33,92.71 101.92,91.12 C22.+ 101.92,87.62 106.9,82.64 111.43,82.64 D8.C 111.73,82.6 112.9,81.44 112.9,78.94 110.9,75.67 110.9,73.41 105.41,67.31 105.41,40.64 102.44,38.75 94.38,38.75 92.89,37.26 v92.89,36.12 | C24.2 59,26.52 59,24.69 56.72,22.4 IC8.OUT
LC1-  (via drill 0.7)
  Top 0.508: D8.A 106.76,77.15 110.67,77.15 115.98,71.84 v115.98,66.18
  Bottom 0.508: D8.A 100.01,83.9 C22.- 100.01,89.86 99.18,90.7 98.32,90.7 95.25,87.63 93.42,87.63 C.2 | v115.98,66.18 115.84,66.04 Q8.C
LC2+  (via drill 0.7)
  Top 0.508: v81.28,85.43 v94.39,85.43
  Bottom 0.508: C.3 91.29,91.03 91.29,92.93 89.58,94.64 83.24,94.64 80.49,91.9 80.32,86.31 81.28,85.11 v81.28,85.43 | v94.39,85.43 97.47,82.87 C25.+ 97.47,80.06 98.67,78.87 101.24,78.87 104.14,75.97 104.14,68.58 | IC9.OUT 88.26,34.29 90.78,35.53 90.78,37.95 C27.2 91.01,38.18 94.61,41.26 94.84,41.49 101.1,41.49 104.14,44.53 104.14,68.58 | 104.14,68.58 109.22,73.66 D9.C
LC2-
  Bottom 0.508: C.4 90.17,86.36 C25.- 95.57,78.42 D9.A 99.01,74.75 96.04,71.78 96.04,59.89 92.67,56.52 92.67,54.01 88.26,49.61 85.29,49.61 Q9.C
LC3+
  Top 0.508: C30.2 94.95,29.32 94.95,36.89 92.18,40.11 82.55,40.11 80.72,41.94 80.72,54.86 73.01,60.18 73.01,65.51 84.21,73.04 84.38,76.12 D10.C
  Bottom 0.508: D10.C 86.91,76.2 88.04,77.32 88.04,81.19 C28.+ 82.72,86.51 82.72,90.7 85.12,93.1 88.04,93.1 88.9,92.23 C.5 | C30.2 94.44,26.52 94.44,24.69 92.15,22.4 IC10.OUT
LC3-  (via drill 0.7)
  Top 0.508: v101.98,69.04 94.89,76.12 D10.A
  Bottom 0.508: C.6 87.63,85.79 89.92,83.5 89.92,81.35 C28.- 89.75,81.18 89.75,77.32 90.88,76.2 D10.A | v101.98,69.04 101.98,61.38 101.98,60.81 101.98,46.86 101.58,46.46 95.18,46.46 93.98,45.26 83.69,45.26 79.58,49.38 77.52,49.38 Q10.C
LD1+
  Bottom 0.508: IC11.OUT 147.32,72.39 C33.2 142.24,76.2 D11.C 138.57,96.7 129.53,96.7 127.76,94.93 C31.+ 123.43,94.93 D.1
LD1-
  Bottom 0.508: D.2 122.39,88.34 C31.- 127.13,93.04 131.93,93.04 D11.A 132.08,82.83 142.9,71.5 142.9,66.69 142.39,66.18 139.84,66.18 Q11.C
LD2+  (via drill 0.7)
  Top 0.508: v109.47,85.55 v121.3,85.55
  Bottom 0.508: IC12.OUT 128.27,72.39 C36.2 124.42,74.97 D12.C 124.42,77.51 123.19,78.74 119.71,78.74 118.38,80.07 118.38,81.77 C34.+ 118.74,82.64 121.23,84.01 121.3,84.53 v121.3,85.55 | D.3 116.84,92.24 115.13,93.95 109.98,93.95 107.93,91.9 107.93,86.92 v109.47,85.55
LD2-
  Bottom 0.508: D.4 115.57,83.82 116.52,82.87 C34.- 116.52,81.12 114.27,78.87 D12.A 114.26,76.47 116.33,74.41 120.1,74.41 124.38,70.12 124.38,67.21 123.18,66.01 120.68,66.01 Q12.C
MA1+
  Top 0.508: D1.C 56.95,80.47 52.6,80.47 42.77,70.64 28.8,70.64 25.03,74.58 22.31,74.58 12.94,65.21 13.11,43.72 16.03,40.8 37.63,40.8 38.73,39.7 C3.2
  Bottom 0.508: A.1 44.88,92.58 51.35,92.58 53.34,90.59 C1.+ 53.34,84.25 53.4,84.18 53.54,84.18 D1.C | IC1.OUT 38.66,36.12 38.66,37.95 C3.2
MA1-  (via drill 0.7)
  Top 0.508: D1.A 46.89,80.47 46.89,79.78 42.77,74.12 28.37,74.12 25.56,76.94 22.2,76.94 11.45,66.19 11.45,47.26 11.46,41.85 22.28,31.04 38.29,31.04 41.57,34.32 41.57,41.89 v40.26,43.2
  Bottom 0.508: C1.- 48.73,88.34 | 48.73,88.34 A.2 | D1.A 46.91,86.53 48.73,88.34 | 46.43,49.38 48.26,49.38 Q1.D 45.15,49.53 44.15,48.52 44.15,45.43 43.46,44.75 41.8,44.75 v40.26,43.2
MA2+  (via drill 0.7)
  Top 0.508: C6.2 41.4,26.75 43.12,30.18 43.12,40.8 44.72,42.41 44.72,54.45 47.8,58.4 47.8,71.78 48.26,72.24 D2.C | v33.52,84.53 34.2,85.21 43.12,85.21 43.8,84.53 v44.15,84.53
  Bottom 0.508: D2.C 44.38,72.39 42.6,74.17 42.6,79.95 C4.+ 44.15,81.61 v44.15,84.53 | A.3 40.64,92.66 38.83,94.47 30.09,94.47 28.44,96.11 20.76,96.11 14.31,89.67 14.31,85.04 16.2,82.91 31.97,82.98 v33.52,84.53 | C6.2 41.17,26.52 41.17,24.69 38.89,22.4 IC2.OUT
MA2-
  Bottom 0.508: 38.99,73.28 39.05,73.34 C4.- 39.37,80.33 A.4 | 38.99,73.28 D2.A | Q2.D 40.72,49.61 41.17,49.61 47.12,55.55 47.12,66.06 40.03,73.15 39.12,73.15 38.99,73.28
MA3+  (via drill 0.7)
  Top 0.508: C9.2 27.23,48.46 27.19,49.6 26.11,50.68 24.43,50.68 22.89,52.22 22.88,53.49 22.88,72.01 23.11,72.24 D3.C
  Top 0.61: v28.89,90.87 28.89,84.18 v25.29,80.92
  Bottom 0.508: A.5 38.1,91.6 37.12,92.58 30.36,92.58 v28.89,90.87 | D3.C 26.86,72.38 28.54,74.07 28.54,78.71 C7.+ | C9.2 27.23,48.23 27.23,46.18 24.94,43.89 IC3.OUT
  Bottom 0.61: v25.29,80.92 27,80.92 28.37,79.55 28.37,78.94 C7.+
MA3-  (via drill 0.7)
  Top 0.508: v29.29,62.64 v29.29,55.32
  Bottom 0.508: A.6 36.94,88.23 36.94,84.7 32.26,78.74 C7.- 32.07,73.77 D3.A 32.71,72.92 26.09,66.29 26.09,64.69 28.14,62.64 v29.29,62.64 | v29.29,55.32 32.49,52.12 32.94,52.12 Q3.D
MA4+
  Top 0.508: C12.2 28.37,19.2 28.37,21.64 9.46,38.77 9.46,69.17 16.51,76.05 D4.C 16.48,84.91
  Bottom 0.508: D4.C 16.54,85.12 16.54,87.54 22.35,93.34 C10.+ 23.59,93.37 25.04,93.37 26.07,92.07 27.86,89.15 28.71,88.3 31.12,88.3 33.7,90.88 A.7 | C12.2 28.37,18.97 28.37,16.92 26.09,14.63 IC4.OUT
MA4-  (via drill 0.7)
  Top 0.508: v19.91,77.5 19.91,78.28 26.54,84.91 D4.A
  Bottom 0.508: Q4.D 25.4,58.52 17.86,58.52 16.37,60.01 16.37,68.58 17.74,69.95 17.74,74.75 19.91,76.92 v19.91,77.5 | A.8 31.04,85.09 D4.A C10.-
N$1
  Bottom 0.406: R1.P$2 49.53,53.34 Q1.G
N$2
  Bottom 0.508: R19.P$2 9.52,90.88 MIDI_OUT.2
N$3
  Bottom 0.406: R2.P$2 45.47,57.9 40.64,53.07 Q2.G
N$4
  Bottom 0.406: R10.P$2 59.69,59.04 60.95,57.78 71.76,57.78 Q10.B
N$5
  Bottom 0.406: R11.P$2 110.99,32.38 139.64,61.04 139.64,63.44 Q11.B
N$6
  pour Top (isolate 0.813): 53.52,5.78 95.43,5.78 95.43,0.7 53.52,0.7
N$9
  Bottom 0.406: R9.P$2 62.23,59.75 63.01,59.15 78.01,59.15 Q9.B
N$14
  Bottom 0.406: R3.P$2 42.93,58.45 39,54.52 33.11,54.52 Q3.G
N$15
  Bottom 0.406: R4.P$2 40.39,59.33 38.49,57.44 32.49,57.44 29.06,60.87 25.49,60.87 Q4.G
N$16
  Bottom 0.406: R5.P$2 57.15,56.77 58.38,55.72 67.57,55.72 Q5.B
N$18
  Bottom 0.406: R6.P$2 54.78,55.89 56.15,54.52 59.78,54.52 Q6.B
N$19
  Bottom 0.406: R7.P$2 52.07,55.88 Q7.B
N$20
  Bottom 0.406: R8.P$2 111.76,45.47 Q8.B
N$21
  Bottom 0.406: R12.P$2 109.76,34.92 120.61,45.78 120.61,63.46 Q12.B
N$25
  Bottom 0.406: D16.A 130.81,19.05 128.27,21.59 OK1.3 128.27,25.32 130.21,27.26 136.56,27.26 137.07,27.77 137.07,34.98 144.79,42.69 150.49,42.69 MIDI_IN.3
N$26
  Bottom 0.406: OK1.2 D16.C R16.P$1
N$27
  Bottom 0.406: R16.P$2 136.53,15.88 139.7,19.05 139.7,34.35 142.73,37.38 150.48,37.38 MIDI_IN.2
N$29  (via drill 0.7)
  Top 0.406: v125.73,35.56 R18.P$1
  Bottom 0.406: v125.73,35.56 OK1.7
P2
  Top 0.406: B1.2 R9.P$1
P3
  Top 0.406: B1.3 R10.P$1
P4
  Top 0.406: B1.4 R5.P$1
P5
  Top 0.406: B1.5 R6.P$1
P6
  Top 0.406: B1.6 R7.P$1
P7
  Top 0.406: B1.7 R1.P$1
P8
  Top 0.406: R2.P$1 B1.8
P9
  Top 0.406: R3.P$1 B1.9
P10
  Top 0.406: R4.P$1 B1.10
P44
  Top 0.406: B1.44 97.79,36.33 98.67,37.2 R8.P$1
P45
  Top 0.406: B1.45 R12.P$1
P46
  Top 0.406: B1.46 97.79,31.22 98.67,30.35 101.92,30.35 103.5,31.93 R11.P$1
PRX  (via drill 0.7)
  Top 0.508: v123.47,40.69 123.47,44.58 90.09,77.95 86.89,77.95 85.24,80.3 85.24,81.84 84.32,82.75 79.86,82.75 73.98,78.07 54.66,78.07 52.72,77.15 52.72,75.95 61.06,69.39 63.45,69.39 67.23,65.61 B1.0
  Bottom 0.406: R17.P$2 B1.0
  Bottom 0.508: OK1.6 128.27,35.89 v123.47,40.69
PTX  (via drill 0.7)
  Top 0.508: B1.1 64.72,65.61 62.95,67.89 60.6,67.89 52.89,74.07 47.57,74.07 43.23,69.38 26.26,69.38 v26.03,69.61
  Bottom 0.508: v26.03,69.61 22.83,69.61 21.66,70.77 21.66,79.53 20.6,80.59 16,80.59 12.14,85.72 3.91,85.72 MIDI_OUT.3

### Text on the board
Top: PHOBOS EnsembleOne v1.1h
Document: (human fabrication)
tSilk: BOWLS | MEDALS | SHAKERS | WOOD | GND-5V-TX | GND-5V-RX | 12Va-GND-12VL-5VM | Va-GND-12V-5V